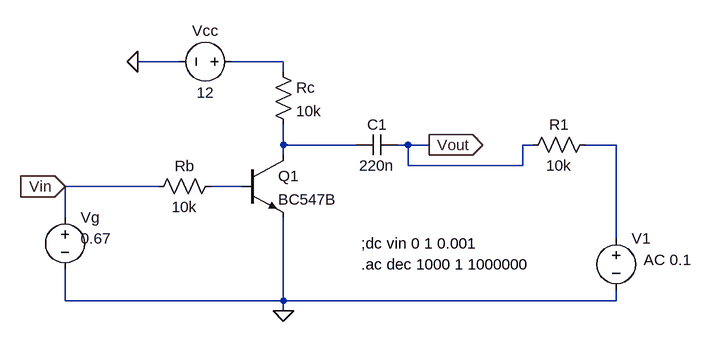
[diagram p0: schematic circuito-2.asc]
circuito-2.asc, the LTspice schematic file:
Version 4
SHEET 1 880 680
WIRE 80 -16 16 -16
WIRE 240 -16 160 -16
WIRE 240 0 240 -16
WIRE 240 112 240 80
WIRE 352 112 240 112
WIRE 432 112 416 112
WIRE 464 112 432 112
WIRE 624 112 608 112
WIRE 752 112 704 112
WIRE 240 128 240 112
WIRE 432 144 432 112
WIRE 608 144 608 112
WIRE 608 144 432 144
WIRE 48 176 -96 176
WIRE 176 176 128 176
WIRE -96 224 -96 176
WIRE 752 256 752 112
WIRE -96 352 -96 304
WIRE 240 352 240 224
WIRE 240 352 -96 352
WIRE 752 352 752 336
WIRE 752 352 240 352
WIRE 240 368 240 352
FLAG 16 -16 0
FLAG 240 368 0
FLAG 464 112 Vout
IOPIN 464 112 Out
FLAG -96 176 Vin
IOPIN -96 176 In
SYMBOL res 144 160 R90
WINDOW 0 0 56 VBottom 2
WINDOW 3 32 56 VTop 2
SYMATTR InstName Rb
SYMATTR Value 10k
SYMBOL npn 176 128 R0
SYMATTR InstName Q1
SYMATTR Value BC547B
SYMBOL res 224 -16 R0
SYMATTR InstName Rc
SYMATTR Value 10k
SYMBOL voltage 176 -16 R90
WINDOW 0 -32 56 VBottom 2
WINDOW 3 32 56 VTop 2
SYMATTR InstName Vcc
SYMATTR Value 12
SYMBOL voltage -96 208 R0
WINDOW 3 24 48 Left 2
WINDOW 123 0 0 Left 0
WINDOW 39 0 0 Left 0
SYMATTR InstName Vg
SYMATTR Value 0.67
SYMBOL cap 416 96 R90
WINDOW 0 0 32 VBottom 2
WINDOW 3 32 32 VTop 2
SYMATTR InstName C1
SYMATTR Value 220n
SYMBOL voltage 752 240 R0
WINDOW 123 42 49 Left 2
WINDOW 39 0 0 Left 0
SYMATTR InstName V1
SYMATTR Value ""
SYMATTR Value2 AC 0.1
SYMBOL res 720 96 R90
WINDOW 0 0 56 VBottom 2
WINDOW 3 32 56 VTop 2
SYMATTR InstName R1
SYMATTR Value 10k
TEXT 360 264 Left 2 !;dc vin 0 1 0.001
TEXT 360 296 Left 2 !.ac dec 1000 1 1000000

The netlist it stands for:
* circuito-2.asc
Rb N004 Vin 10k
Q1 N002 N004 0 0 BC547B
Rc N001 N002 10k
Vcc N001 0 12
Vg Vin 0 0.67
C1 Vout N002 220n
V1 N003 0 AC 0.1
R1 N003 Vout 10k
.model NPN NPN
.model PNP PNP
.lib standard.bjt
;dc vin 0 1 0.001
.ac dec 1000 1 1000000
.backanno
.end